# Altium schematic sheet Testkit.SchDoc: Test Kit
size A4; ENG_APP_DATE: --/--/--; DSN_APP_DATE: --/--/--; CHK_APP_DATE: --/--/--; Date: 03.11.2023; ApprovedBy: M.Sc. Tobias Wirth; CheckedBy: M.Sc. Tobias Wirth; Author: M.Sc. Tobias Wirth; CompanyName: University of Stuttgart; DrawnBy: M.Sc. Tobias Wirth; Engineer: M.Sc. Tobias Wirth; Organization: IIS; Address1: Pfaffenwaldring 47; Address2: 70569 Stuttgart; Revision: V0.1; SheetNumber: 1; SheetTotal: 1; ProjectNameAlt: AUS - NMR System; Time: 23:30; ImagePath: N/A; Application_BuildNumber: N/A
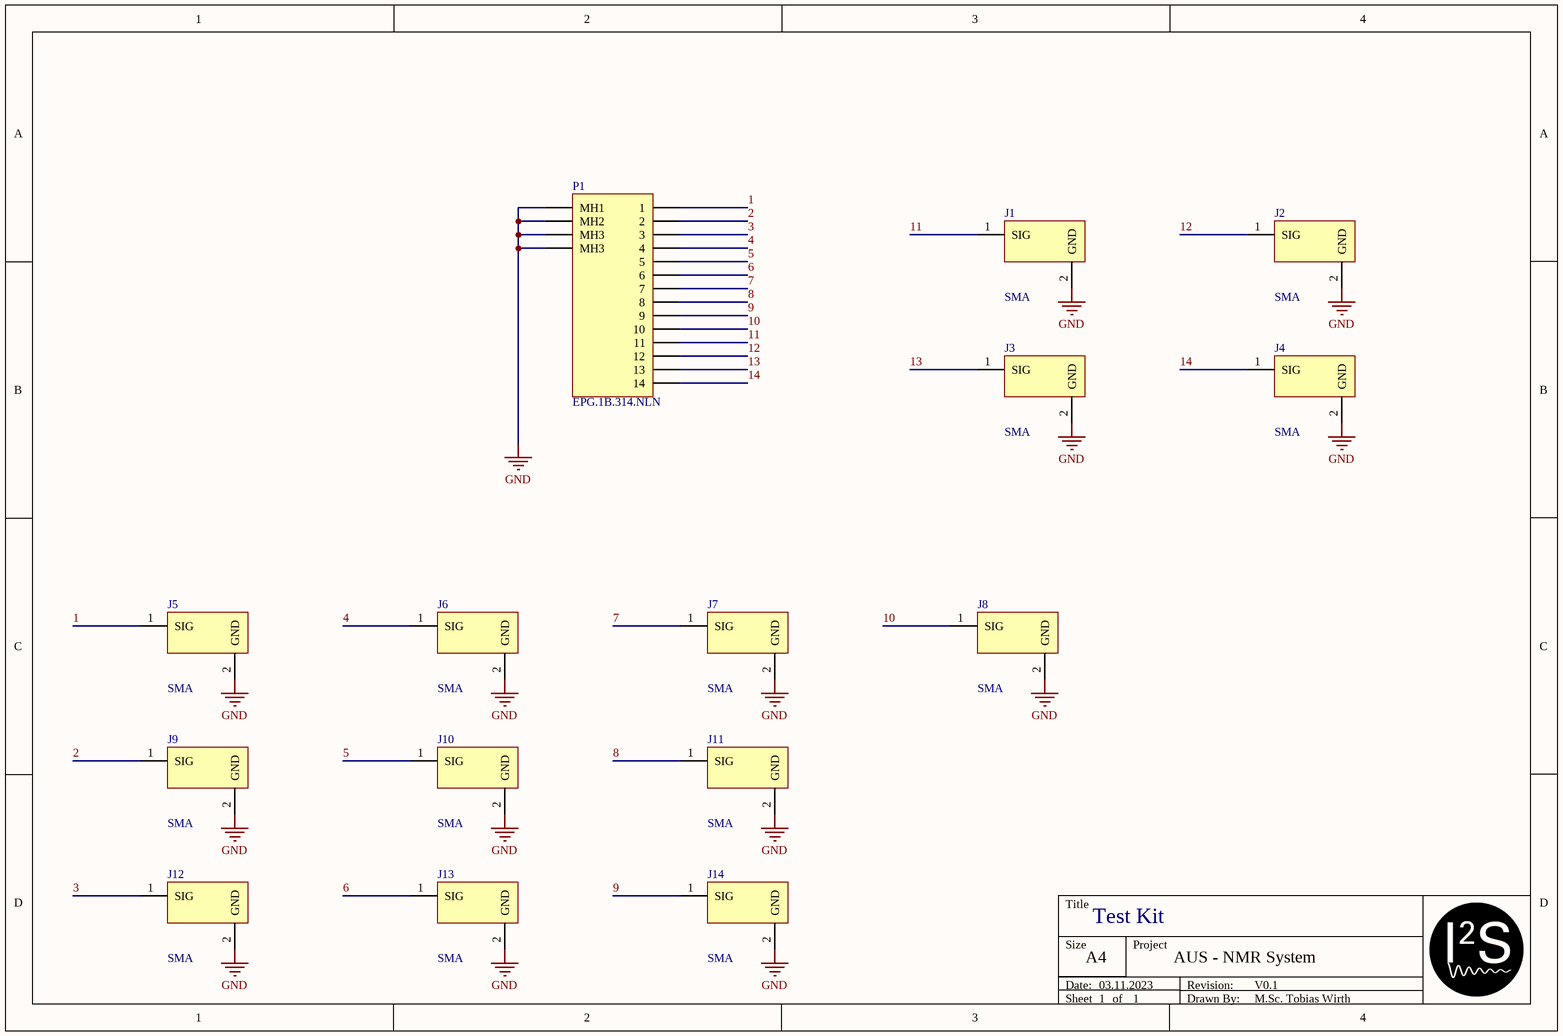
[diagram p0: Testkit.SchDoc]

## Parts
J1  SMA  [SMA]
J2  SMA  [SMA]
J3  SMA  [SMA]
J4  SMA  [SMA]
J5  SMA  [SMA]
J6  SMA  [SMA]
J7  SMA  [SMA]
J8  SMA  [SMA]
J9  SMA  [SMA]
J10  SMA  [SMA]
J11  SMA  [SMA]
J12  SMA  [SMA]
J13  SMA  [SMA]
J14  SMA  [SMA]
P1  EPG.1B.314.NLN  [EPG.1B.314.NLN]

## Nets
GND: J1.2(GND) J2.2(GND) J3.2(GND) J4.2(GND) J5.2(GND) J6.2(GND) J7.2(GND) J8.2(GND) J9.2(GND) J10.2(GND) J11.2(GND) J12.2(GND) J13.2(GND) J14.2(GND) P1.15(MH1) P1.16(MH2) P1.17(MH3) P1.18(MH3)
1: J5.1(SIG) P1.1
2: J9.1(SIG) P1.2
3: J12.1(SIG) P1.3
4: J6.1(SIG) P1.4
5: J10.1(SIG) P1.5
6: J13.1(SIG) P1.6
7: J7.1(SIG) P1.7
8: J11.1(SIG) P1.8
9: J14.1(SIG) P1.9
10: J8.1(SIG) P1.10
11: J1.1(SIG) P1.11
12: J2.1(SIG) P1.12
13: J3.1(SIG) P1.13
14: J4.1(SIG) P1.14

## Notes on the sheet
- Title
- Size
- Date:
- Sheet
- A4
- of
- Project
- Drawn By:
- Revision:

## Library data of the parts
P1 = EPG.1B.314.NLN: LEMO Connector - 14 pin EPG.1B.314.NLN Elbow receptacle for printed circuit (solder mount), Female Contact Drawing Rev. 00 Source: http://www.lemo.com/catalog/ROW/UK_English/unipole_multipole.pdf